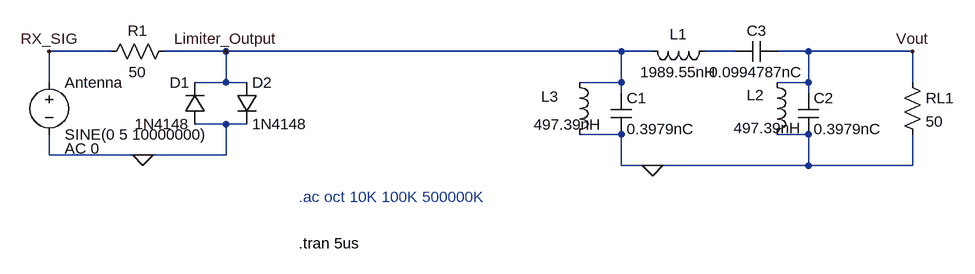
[diagram p0: schematic Draft1 copy.asc]
Draft1 copy.asc, the LTspice schematic file:
Version 4
SHEET 1 1440 680
WIRE 80 240 -16 240
WIRE 256 240 160 240
WIRE 864 240 256 240
WIRE 912 240 864 240
WIRE 1040 240 992 240
WIRE 1152 240 1104 240
WIRE 1312 240 1152 240
WIRE -16 288 -16 240
WIRE 256 288 256 240
WIRE 256 288 208 288
WIRE 288 288 256 288
WIRE 864 288 864 240
WIRE 864 288 800 288
WIRE 1152 288 1152 240
WIRE 1152 288 1104 288
WIRE 1312 288 1312 240
WIRE 864 304 864 288
WIRE 1152 304 1152 288
WIRE 256 352 208 352
WIRE 288 352 256 352
WIRE 864 368 800 368
WIRE 1152 368 1104 368
WIRE -16 400 -16 368
WIRE 128 400 -16 400
WIRE 256 400 256 352
WIRE 256 400 128 400
WIRE 864 416 864 368
WIRE 912 416 864 416
WIRE 1152 416 1152 368
WIRE 1152 416 912 416
WIRE 1312 416 1312 368
WIRE 1312 416 1152 416
FLAG 128 400 0
FLAG 256 240 Limiter_Output
FLAG -16 240 RX_SIG
FLAG 912 416 0
FLAG 1312 240 Vout
SYMBOL Voltage -16 272 R0
WINDOW 123 24 118 Left 2
SYMATTR Value2 AC 0
SYMATTR InstName Antenna
SYMATTR Value SINE(0 5 10000000)
SYMBOL Res 176 224 R90
WINDOW 0 0 56 VBottom 2
WINDOW 3 32 56 VTop 2
SYMATTR InstName R1
SYMATTR Value 50
SYMBOL diode 224 352 R180
WINDOW 0 24 64 Left 2
WINDOW 3 24 0 Left 2
SYMATTR InstName D1
SYMATTR Value 1N4148
SYMBOL diode 272 288 R0
SYMATTR InstName D2
SYMATTR Value 1N4148
SYMBOL Cap 848 304 R0
SYMATTR InstName C1
SYMATTR Value 0.3979nC
SYMBOL Cap 1136 304 R0
SYMATTR InstName C2
SYMATTR Value 0.3979nC
SYMBOL Ind 1008 224 R90
WINDOW 0 5 56 VBottom 2
WINDOW 3 32 56 VTop 2
SYMATTR InstName L1
SYMATTR Value 1989.55nH
SYMBOL Res 1296 272 R0
SYMATTR InstName RL1
SYMATTR Value 50
SYMBOL ind 1088 272 R0
WINDOW 0 -31 35 Left 2
WINDOW 3 -51 86 Left 2
SYMATTR InstName L2
SYMATTR Value 497.39nH
SYMBOL Ind 784 272 R0
WINDOW 0 -43 38 Left 2
WINDOW 3 -55 81 Left 2
SYMATTR InstName L3
SYMATTR Value 497.39nH
SYMBOL Cap 1104 224 R90
WINDOW 0 0 32 VBottom 2
WINDOW 3 32 32 VTop 2
SYMATTR InstName C3
SYMATTR Value 0.0994787nC
TEXT 368 464 Left 2 ;.ac oct 10K 100K 500000K
TEXT 368 536 Left 2 !.tran 5us

The netlist it stands for:
* Draft1 copy.asc
V§Antenna RX_SIG 0 SINE(0 5 10000000) AC 0
R1 Limiter_Output RX_SIG 50
D1 0 Limiter_Output 1N4148
D2 Limiter_Output 0 1N4148
C1 Limiter_Output 0 0.3979nC
C2 Vout 0 0.3979nC
L1 N001 Limiter_Output 1989.55nH
RL1 Vout 0 50
L2 Vout 0 497.39nH
L3 Limiter_Output 0 497.39nH
C3 Vout N001 0.0994787nC
.model D D
.lib standard.dio
* .ac oct 10K 100K 500000K
.tran 5us
.backanno
.end